# Altium schematic sheet 21 CAN.SchDoc
size 420 x 297 mm; Address1: Address1; Address2: Address2; Address3: Address3; Address4: Address4; DocumentNumber: АБВГ.123456.001 Э3; SheetNumber: 21; SheetTotal: 23; Scale: 1:1; DocumentType: Схема электрическая принципиальная; FirstReferrence: АБВГ.123456.001
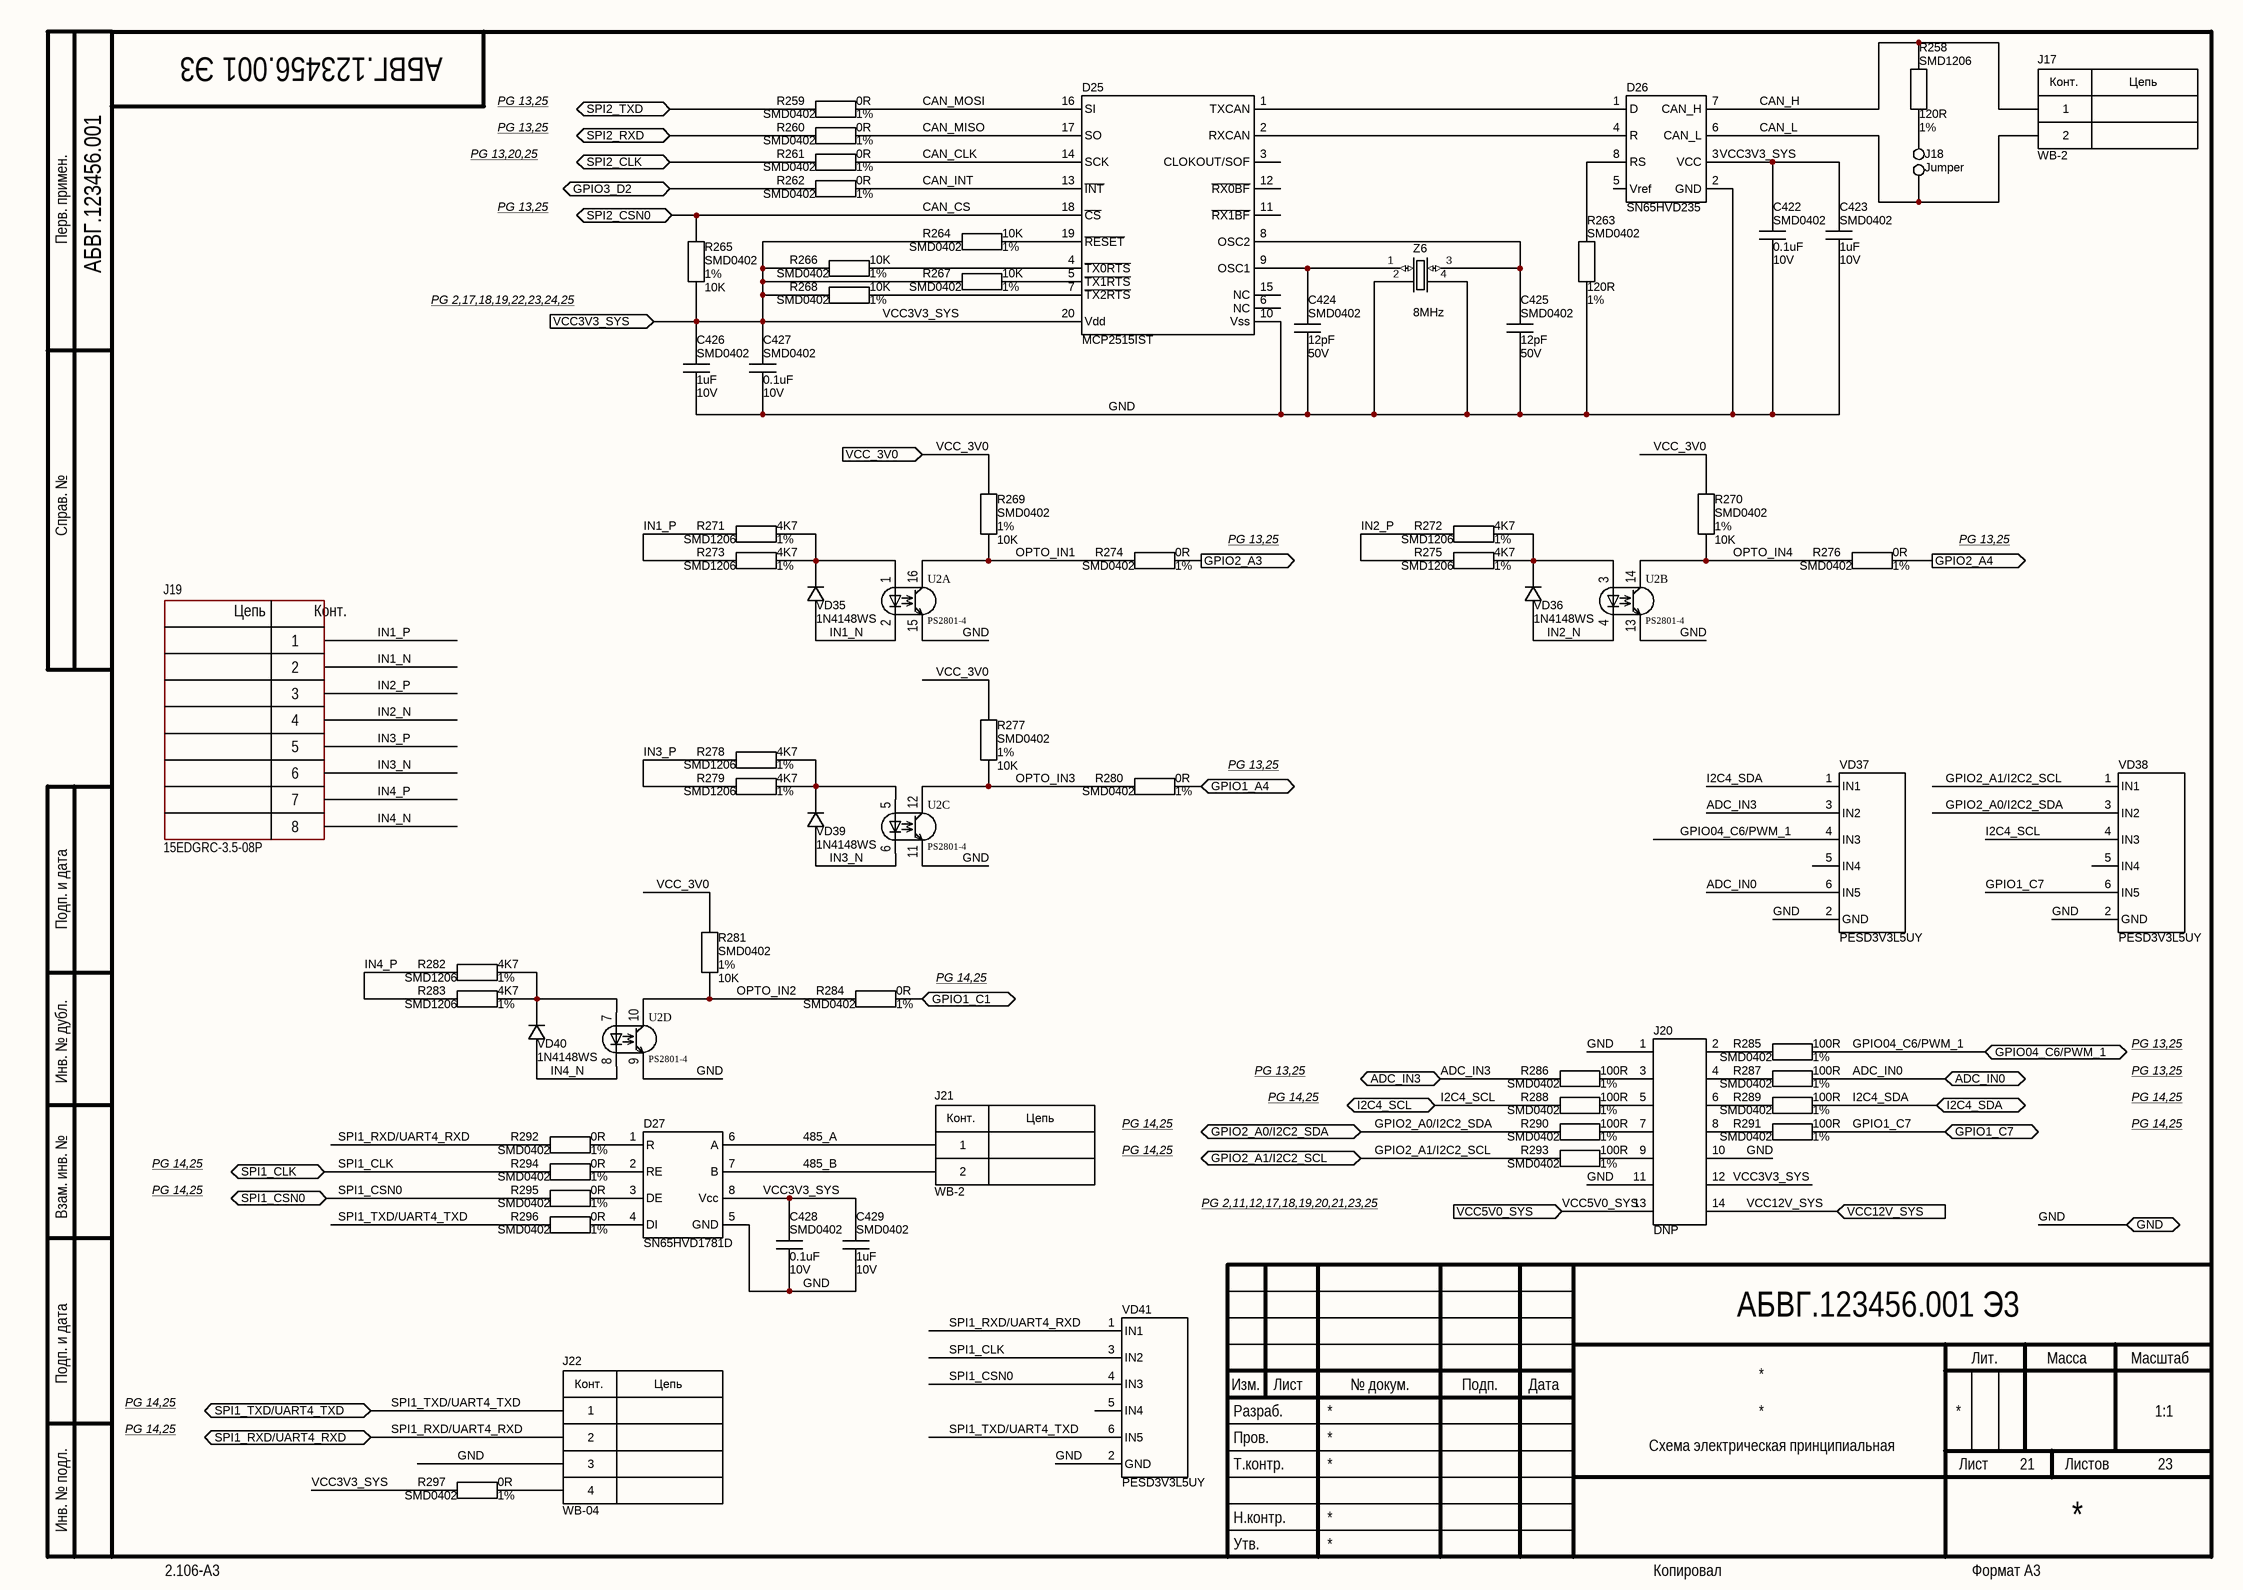
[diagram p0: 21 CAN.SchDoc]

## Parts
C422  Package: SMD0402  Voltage: 10V  [CAP_SMD_0402]  (hidden comment: 0.1uF)
C423  Package: SMD0402  Voltage: 10V  [CAP_SMD_0402]  (hidden comment: 1uF)
C424  Package: SMD0402  Voltage: 50V  [CAP_SMD_0402]  (hidden comment: 12pF)
C425  Package: SMD0402  Voltage: 50V  [CAP_SMD_0402]  (hidden comment: 12pF)
C426  Package: SMD0402  Voltage: 10V  [CAP_SMD_0402]  (hidden comment: 1uF)
C427  Package: SMD0402  Voltage: 10V  [CAP_SMD_0402]  (hidden comment: 0.1uF)
C428  Package: SMD0402  Voltage: 10V  [CAP_SMD_0402]  (hidden comment: 0.1uF)
C429  Package: SMD0402  Voltage: 10V  [CAP_SMD_0402]  (hidden comment: 1uF)
D25  MCP2515IST  [TSSOP-20]
D26  SN65HVD235  [SO8]
D27  SN65HVD1781D  [SO8]
J17  WB-2  [15EDGRC-3.5-02P]
J18  Jumper  [Jumper2]
J19  15EDGRC-3.5-08P  [15EDGRC-3.5-08P]
J20  DNP  [PLD2-14 (2.00)]
J21  WB-2  [15EDGRC-3.5-02P]
J22  WB-04  [WB-4]
R258  Package: SMD1206  Tolerance: 1%  [RES_SMD_1206]  (hidden comment: 120R)
R259  Package: SMD0402  Tolerance: 1%  [RES_SMD_0402]  (hidden comment: 0R)
R260  Package: SMD0402  Tolerance: 1%  [RES_SMD_0402]  (hidden comment: 0R)
R261  Package: SMD0402  Tolerance: 1%  [RES_SMD_0402]  (hidden comment: 0R)
R262  Package: SMD0402  Tolerance: 1%  [RES_SMD_0402]  (hidden comment: 0R)
R263  Package: SMD0402  Tolerance: 1%  [RES_SMD_0402]  (hidden comment: 120R)
R264  Package: SMD0402  Tolerance: 1%  [RES_SMD_0402]  (hidden comment: 10K)
R265  Package: SMD0402  Tolerance: 1%  [RES_SMD_0402]  (hidden comment: 10K)
R266  Package: SMD0402  Tolerance: 1%  [RES_SMD_0402]  (hidden comment: 10K)
R267  Package: SMD0402  Tolerance: 1%  [RES_SMD_0402]  (hidden comment: 10K)
R268  Package: SMD0402  Tolerance: 1%  [RES_SMD_0402]  (hidden comment: 10K)
R269  Package: SMD0402  Tolerance: 1%  [RES_SMD_0402]  (hidden comment: 10K)
R270  Package: SMD0402  Tolerance: 1%  [RES_SMD_0402]  (hidden comment: 10K)
R271  Package: SMD1206  Tolerance: 1%  [RES_SMD_1206]  (hidden comment: 4K7)
R272  Package: SMD1206  Tolerance: 1%  [RES_SMD_1206]  (hidden comment: 4K7)
R273  Package: SMD1206  Tolerance: 1%  [RES_SMD_1206]  (hidden comment: 4K7)
R274  Package: SMD0402  Tolerance: 1%  [RES_SMD_0402]  (hidden comment: 0R)
R275  Package: SMD1206  Tolerance: 1%  [RES_SMD_1206]  (hidden comment: 4K7)
R276  Package: SMD0402  Tolerance: 1%  [RES_SMD_0402]  (hidden comment: 0R)
R277  Package: SMD0402  Tolerance: 1%  [RES_SMD_0402]  (hidden comment: 10K)
R278  Package: SMD1206  Tolerance: 1%  [RES_SMD_1206]  (hidden comment: 4K7)
R279  Package: SMD1206  Tolerance: 1%  [RES_SMD_1206]  (hidden comment: 4K7)
R280  Package: SMD0402  Tolerance: 1%  [RES_SMD_0402]  (hidden comment: 0R)
R281  Package: SMD0402  Tolerance: 1%  [RES_SMD_0402]  (hidden comment: 10K)
R282  Package: SMD1206  Tolerance: 1%  [RES_SMD_1206]  (hidden comment: 4K7)
R283  Package: SMD1206  Tolerance: 1%  [RES_SMD_1206]  (hidden comment: 4K7)
R284  Package: SMD0402  Tolerance: 1%  [RES_SMD_0402]  (hidden comment: 0R)
R285  Package: SMD0402  Tolerance: 1%  [RES_SMD_0402]  (hidden comment: 100R)
R286  Package: SMD0402  Tolerance: 1%  [RES_SMD_0402]  (hidden comment: 100R)
R287  Package: SMD0402  Tolerance: 1%  [RES_SMD_0402]  (hidden comment: 100R)
R288  Package: SMD0402  Tolerance: 1%  [RES_SMD_0402]  (hidden comment: 100R)
R289  Package: SMD0402  Tolerance: 1%  [RES_SMD_0402]  (hidden comment: 100R)
R290  Package: SMD0402  Tolerance: 1%  [RES_SMD_0402]  (hidden comment: 100R)
R291  Package: SMD0402  Tolerance: 1%  [RES_SMD_0402]  (hidden comment: 100R)
R292  Package: SMD0402  Tolerance: 1%  [RES_SMD_0402]  (hidden comment: 0R)
R293  Package: SMD0402  Tolerance: 1%  [RES_SMD_0402]  (hidden comment: 100R)
R294  Package: SMD0402  Tolerance: 1%  [RES_SMD_0402]  (hidden comment: 0R)
R295  Package: SMD0402  Tolerance: 1%  [RES_SMD_0402]  (hidden comment: 0R)
R296  Package: SMD0402  Tolerance: 1%  [RES_SMD_0402]  (hidden comment: 0R)
R297  Package: SMD0402  Tolerance: 1%  [RES_SMD_0402]  (hidden comment: 0R)
U2  PS2801-4  [SOIC127P700X210-16N]  (parts A,B,C,D of 4)
VD35  value 1N4148WS  [SOD323]  (hidden comment: Diode)
VD36  value 1N4148WS  [SOD323]  (hidden comment: Diode)
VD37  PESD3V3L5UY  [SC70-6]
VD38  PESD3V3L5UY  [SC70-6]
VD39  value 1N4148WS  [SOD323]  (hidden comment: Diode)
VD40  value 1N4148WS  [SOD323]  (hidden comment: Diode)
VD41  PESD3V3L5UY  [SC70-6]
Z6  value 8MHz  [TSX3225]  (hidden comment: Value)

## Ports
ADC_IN0 (bidir), ADC_IN3 (bidir), GND (bidir), GPIO1_A4 (bidir), GPIO1_C1 (bidir), GPIO1_C7 (bidir), GPIO2_A0/I2C2_SDA (bidir), GPIO2_A1/I2C2_SCL (bidir), GPIO2_A3 (out), GPIO2_A4 (out), GPIO3_D2 (bidir), GPIO04_C6/PWM_1 (bidir), I2C4_SCL (bidir), I2C4_SDA (bidir), SPI1_CLK (bidir), SPI1_CSN0 (bidir), SPI1_RXD/UART4_RXD (bidir), SPI1_TXD/UART4_TXD (bidir), SPI2_CLK (bidir), SPI2_CSN0 (bidir), SPI2_RXD (bidir), SPI2_TXD (bidir), VCC3V3_SYS (in), VCC5V0_SYS (in), VCC12V_SYS (in), VCC_3V0 (in)

## Nets
485_A: D27.6(A) J21.1
485_B: D27.7(B) J21.2
ADC_IN0: R287.2 VD37.6(IN5) ; port ADC_IN0
ADC_IN3: R286.1 VD37.3(IN2) ; port ADC_IN3
CAN_CLK: D25.14(SCK) R261.2
CAN_CS: D25.18(~{CS}) R265.2 ; port SPI2_CSN0
CAN_H: D26.7(CAN_H) J17.1 R258.1
CAN_INT: D25.13(~{INT}) R262.2
CAN_L: D26.6(CAN_L) J17.2 J18.1
CAN_MISO: D25.17(SO) R260.2
CAN_MOSI: D25.16(SI) R259.2
GND: C422.2 C423.2 C424.2 C425.2 C426.2 C427.2 C428.2 C429.2 D25.10(Vss) D26.2(GND) D27.5(GND) J20.1 J20.10 J20.11 J22.3 R263.2 U2.9(E) U2.11(E) U2.13(E) U2.15(E) VD37.2(GND) VD38.2(GND) VD41.2(GND) Z6.2(GND) Z6.4(GND) ; port GND
GPIO1_A4: R280.2 ; port GPIO1_A4
GPIO1_C1: R284.2 ; port GPIO1_C1
GPIO1_C7: R291.2 VD38.6(IN5) ; port GPIO1_C7
GPIO2_A0/I2C2_SDA: R290.1 VD38.3(IN2) ; port GPIO2_A0/I2C2_SDA
GPIO2_A1/I2C2_SCL: R293.1 VD38.1(IN1) ; port GPIO2_A1/I2C2_SCL
GPIO2_A3: R274.2 ; port GPIO2_A3
GPIO2_A4: R276.2 ; port GPIO2_A4
GPIO3_D2: R262.1 ; port GPIO3_D2
GPIO04_C6/PWM_1: R285.2 VD37.4(IN3) ; port GPIO04_C6/PWM_1
I2C4_SCL: R288.1 VD38.4(IN3) ; port I2C4_SCL
I2C4_SDA: R289.2 VD37.1(IN1) ; port I2C4_SDA
IN1_N: J19.2 U2.2(C) VD35.1(A)
IN1_P: J19.1 R271.2 R273.2
IN2_N: J19.4 U2.4(C) VD36.1(A)
IN2_P: J19.3 R272.2 R275.2
IN3_N: J19.6 U2.6(C) VD39.1(A)
IN3_P: J19.5 R278.2 R279.2
IN4_N: J19.8 U2.8(C) VD40.1(A)
IN4_P: J19.7 R282.2 R283.2
OPTO_IN1: R269.1 R274.1 U2.16(C)
OPTO_IN2: R281.1 R284.1 U2.10(C)
OPTO_IN3: R277.1 R280.1 U2.12(C)
OPTO_IN4: R270.1 R276.1 U2.14(C)
SPI1_CLK: R294.1 VD41.3(IN2) ; port SPI1_CLK
SPI1_CSN0: R295.1 VD41.4(IN3) ; port SPI1_CSN0
SPI1_RXD/UART4_RXD: J22.2 R292.1 VD41.1(IN1) ; port SPI1_RXD/UART4_RXD
SPI1_TXD/UART4_TXD: J22.1 R296.1 VD41.6(IN5) ; port SPI1_TXD/UART4_TXD
SPI2_CLK: R261.1 ; port SPI2_CLK
SPI2_RXD: R260.1 ; port SPI2_RXD
SPI2_TXD: R259.1 ; port SPI2_TXD
VCC3V3_SYS: C422.1 C423.1 C426.1 C427.1 C428.1 C429.1 D25.20(Vdd) D26.3(VCC) D27.8(Vcc) J20.12 R264.2 R265.1 R266.2 R267.2 R268.2 R297.1 ; port VCC3V3_SYS
VCC5V0_SYS: J20.13 ; port VCC5V0_SYS
VCC12V_SYS: J20.14 ; port VCC12V_SYS
VCC_3V0: R269.2 R270.2 R277.2 R281.2 ; port VCC_3V0
NetC424_1: C424.1 D25.9(OSC1) Z6.1(IN/OUT)
NetC425_1: C425.1 D25.8(OSC2) Z6.3(IN/OUT)
NetD25_1: D25.1(TXCAN) D26.1(D)
NetD25_2: D25.2(RXCAN) D26.4(R)
NetD25_4: D25.4(~{TX0RTS}) R266.1
NetD25_5: D25.5(~{TX1RTS}) R267.1
NetD25_7: D25.7(~{TX2RTS}) R268.1
NetD25_19: D25.19(~{RESET}) R264.1
NetD26_8: D26.8(RS) R263.1
NetD27_1: D27.1(R) R292.2
NetD27_2: D27.2(RE) R294.2
NetD27_3: D27.3(DE) R295.2
NetD27_4: D27.4(DI) R296.2
NetJ18_2: J18.2 R258.2
NetJ20_2: J20.2 R285.1
NetJ20_3: J20.3 R286.2
NetJ20_4: J20.4 R287.1
NetJ20_5: J20.5 R288.2
NetJ20_6: J20.6 R289.1
NetJ20_7: J20.7 R290.2
NetJ20_8: J20.8 R291.1
NetJ20_9: J20.9 R293.2
NetJ22_4: J22.4 R297.2
NetR271_1: R271.1 R273.1 U2.1(A) VD35.2(C)
NetR272_1: R272.1 R275.1 U2.3(A) VD36.2(C)
NetR278_1: R278.1 R279.1 U2.5(A) VD39.2(C)
NetR282_1: R282.1 R283.1 U2.7(A) VD40.2(C)

Not connected (* = marked no-connect by the designer): D25 3(CLOKOUT/SOF) 6(NC) 11(~{RX1BF}) 12(~{RX0BF}) 15(NC); D26 5(Vref); VD37 5(IN4); VD38 5(IN4); VD41 5(IN4)

## Notes on the sheet
- PG 13,25
- PG 13,20,25
- Перв. примен.
- PG 2,17,18,19,22,23,24,25
- Справ. №
- Подп. и дата
- (near R284) PG 14,25
- Инв. № дубл.
- PG 14,25
- PG 2,11,12,17,18,19,20,21,23,25
- Взам. инв. №
- Разраб.
- Изм.
- Лист
- № докум.
- Подп.
- Дата
- Лит.
- Масса
- Масштаб
- Пров.
- Т.контр.
- Листов
- Инв. № подл.
- Утв.
- Н.контр.
- 2.106-A3
- Копировал
- Формат А3
- (in symbol CON2) Конт.; Цепь
- (in symbol CON4) Конт.; Цепь
- (in symbol CON8) Цепь; Конт.

## Library data of the parts
C422 C427 C428 = Ceramic_Cap: PartNumber: CC0402KRX5R6BB104; ComponentType: SMD Ceramic Chip Capacitor; Manufacter: *; Tolerance: *; ClassName: *; Value: 0.1uF
C423 C426 C429 = Ceramic_Cap: PartNumber: CC0402KRX5R6BB105; ComponentType: SMD Ceramic Chip Capacitor; Manufacter: *; Tolerance: *; ClassName: *; Value: 1uF
C424 C425 = Ceramic_Cap: PartNumber: CC0402JRNPO9BN120; ComponentType: SMD Ceramic Chip Capacitor; Manufacter: *; Tolerance: *; ClassName: *; Value: 12pF
D26 = SN65HVD230D: Manufacter: TI; PartNumber: SN65HVD235D; ComponentType: CAN Bus Transceiver; Package: SO8; Value: SN65HVD235
D27 = SN65HVD1781D: Manufacter: TI; ComponentType: RS-485 Transceiver; Package: SO8; PartNumber: SN65HVD1781D; Value: SN65HVD1781D
J17 J21 = CON2: PartNumber: DS1066-02M(MW-2M); ComponentType: *; Manufacter: *; Package: WB-2; ClassName: *; Value: WB-2
J18 = Jumper: PartNumber: DS1025-01-1x2P8BV1-B; ComponentType: *; Manufacter: *; Package: PLS-2(2.00); ClassName: *; Value: Jumper
J19 = CON8: Manufacter: *; Package: 15EDGRC-3.5-08P; PartNumber: 15EDGRC-3.5-08P; ClassName: *; Value: 15EDGRC-3.5-08P
J20 = CON14_2: PartNumber: PLD2-14 (2.00; ComponentType: *; Manufacter: *; Package: PLD2-14 (2.00; ClassName: *; Value: DNP
J22 = CON4: PartNumber: DS1066-04M; Manufacter: *; Package: WB-04; ClassName: *; Value: WB-04
R258 = Chip_Res: PartNumber: RC1206FR-07120RL; ComponentType: SMD Chip Resistor; Manufacter: *; Voltage: *; ClassName: *; Value: 120R
R259-R262 R274 R276 R280 R284 R292 R294-R297 = Chip_Res: PartNumber: RC0402FR-070RL; ComponentType: SMD Chip Resistor; Manufacter: *; Voltage: *; ClassName: *; Value: 0R
R263 = Chip_Res: PartNumber: RC0402FR-07120RL; ComponentType: SMD Chip Resistor; Manufacter: *; Voltage: *; ClassName: *; Value: 120R
R264-R270 R277 R281 = Chip_Res: PartNumber: RC0402FR-0710KL; ComponentType: SMD Chip Resistor; Manufacter: *; Voltage: *; ClassName: *; Value: 10K
R271-R273 R275 R278 R279 R282 R283 = Chip_Res: PartNumber: RC1206FR-074K7L; ComponentType: SMD Chip Resistor; Manufacter: *; Voltage: *; ClassName: *; Value: 4K7
R285-R291 R293 = Chip_Res: PartNumber: RC0402FR-07100RL; ComponentType: SMD Chip Resistor; Manufacter: *; Voltage: *; ClassName: *; Value: 100R
U2 = PS2801-4-F3-A: Optocoupler X4; Manufacturer: Renesas; Comments: 80V, 50mA; PartNumber: PS2801-4-F3-A; Value: PS2801-4; Package: SOIC127P700X210-16N; ClassName: *
Z6 = OSC3225: PartNumber: X32258MOB4SI; ComponentType: *; Manufacter: *; Package: TSX3225
D25 = MCP2515IST: ComponentType: SMD Chip Resistor; Manufacter: *; Voltage: *; ClassName: *; Tolerance: *; PartNumber: MCP2515IST; Package: TSSOP-20; Value: MCP2515IST
VD35 VD36 VD39 VD40 = Diode: ComponentType: *; Manufacter: *; Package: SOD323; PartNumber: 1N4148WS; ClassName: *
VD37 VD38 VD41 = PESD3V3L5UY: ComponentType: *; Manufacter: *; Package: SC70-6; PartNumber: PESD3V3L5UY; ClassName: *; Value: PESD3V3L5UY